# EAGLE design untitled (EAGLE 9.4.2)
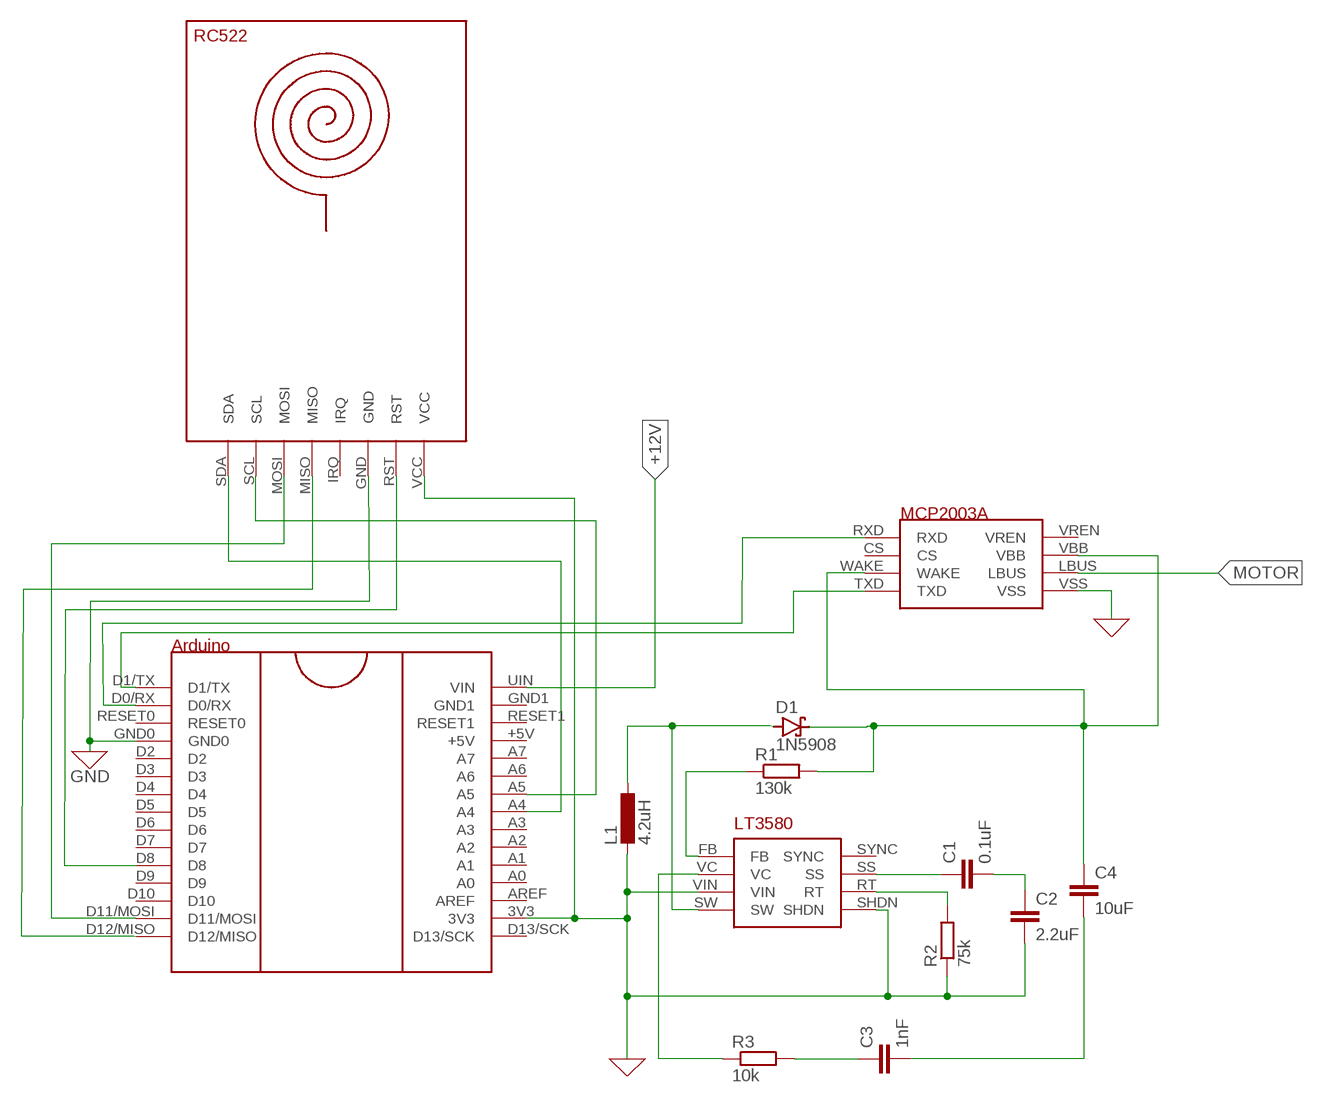
[diagram p0: schematic, sheet 1]

## Parts
C1  0.1uF  C-EU075-032X103  [C075-032X103]
C2  2.2uF  C-EU075-032X103  [C075-032X103]
C3  1nF  C-EU075-032X103  [C075-032X103]
C4  10uF  C-EU075-032X103  [C075-032X103]
D1  1N5908  [C4111-15]
L1  4.2uH  L-EU0207/7  [0207/7]
R1  130k  R-EU_0207/7  [0207/7]
R2  75k  R-EU_0207/7  [0207/7]
R3  10k  R-EU_0207/7  [0207/7]
U$1  ARDUINO  [ARDUINO]
U$2  LIN  [LIN]
U$3  LT3580  [LT3580]
U$4  RC522  [RC522]

## Nets
0: C2.2 L1.2 R2.1 U$1.3V3 U$2.VSS U$3.SHDN U$3.VIN U$4.VCC ; supply symbol labelled GND
+12V: U$1.UIN(VIN)
GND: U$1.GND0 U$4.GND
MOTOR: U$2.LBUS
N$1: C3.1 R3.2
N$2: C1.1 U$3.SS
N$3: C1.2 C2.1
N$4: U$1.A4 U$4.SDA
N$5: R2.2 U$3.RT
N$7: D1.A L1.1 U$3.SW
N$8: C4.1 D1.C R1.2 U$2.VBB U$2.WAKE
N$9: R1.1 U$3.FB
N$10: R3.1 U$3.VC
N$11: C3.2 C4.2
N$15: U$1.A5 U$4.SCL
N$16: U$1.D11/MOSI U$4.MOSI
N$17: U$1.D12/MISO U$4.MISO
N$19: U$1.D8 U$4.RST
N$20: U$1.D0/RX U$2.RXD
N$21: U$1.D1/TX U$2.TXD
Unconnected: U$1.+5V U$1.A0 U$1.A1 U$1.A2 U$1.A3 U$1.A6 U$1.A7 U$1.AREF U$1.D2 U$1.D3 U$1.D4 U$1.D5 U$1.D6 U$1.D7 U$1.D9 U$1.D10 U$1.D13/SCK U$1.GND1 U$1.RESET0 U$1.RESET1 U$2.CS U$2.VREN U$3.SYNC U$4.IRQ

## Library data of the parts
C1-C4 = rcl:C-EU: CAPACITOR, European symbol; SPICEPREFIX: C
D1 = diode:1N5908: DIODE schottky
L1 = rcl:L-EU: INDUCTOR, European symbol; SPICEPREFIX: L
R1-R3 = rcl:R-EU_: RESISTOR, European symbol; SPICEPREFIX: R
U$1 = Diplomarbeit:ARDUINO
U$2 = Diplomarbeit:LIN
U$3 = Diplomarbeit:LT3580
U$4 = Diplomarbeit:RC522

## Board
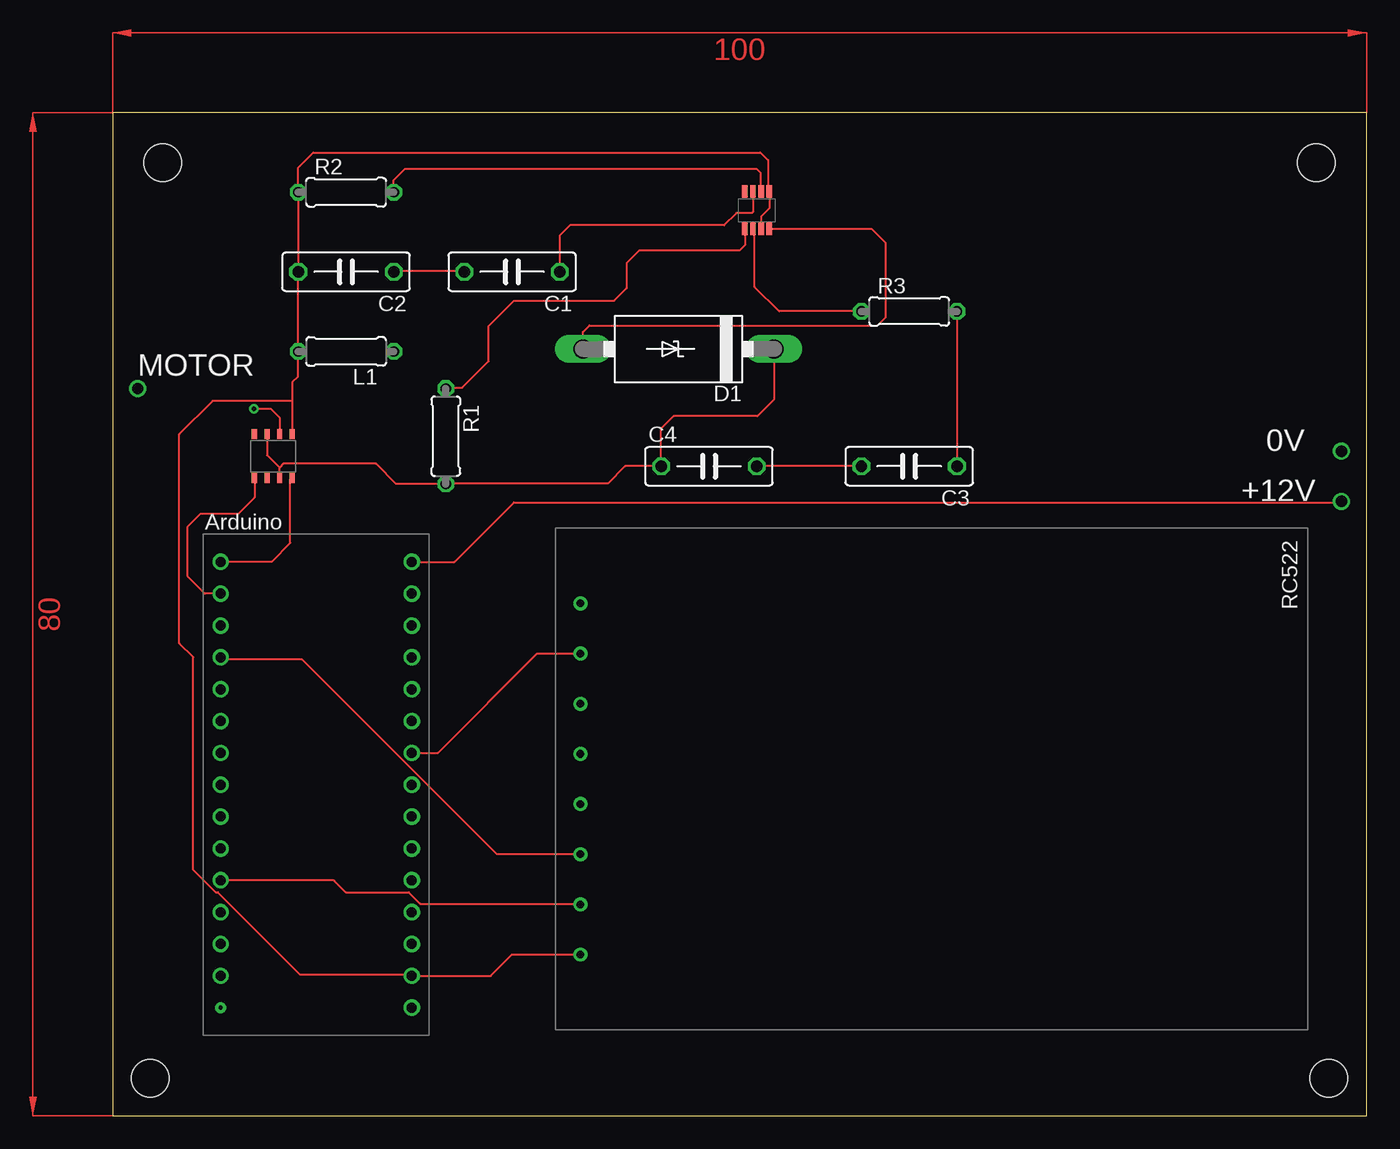
[diagram p1: board, top side]
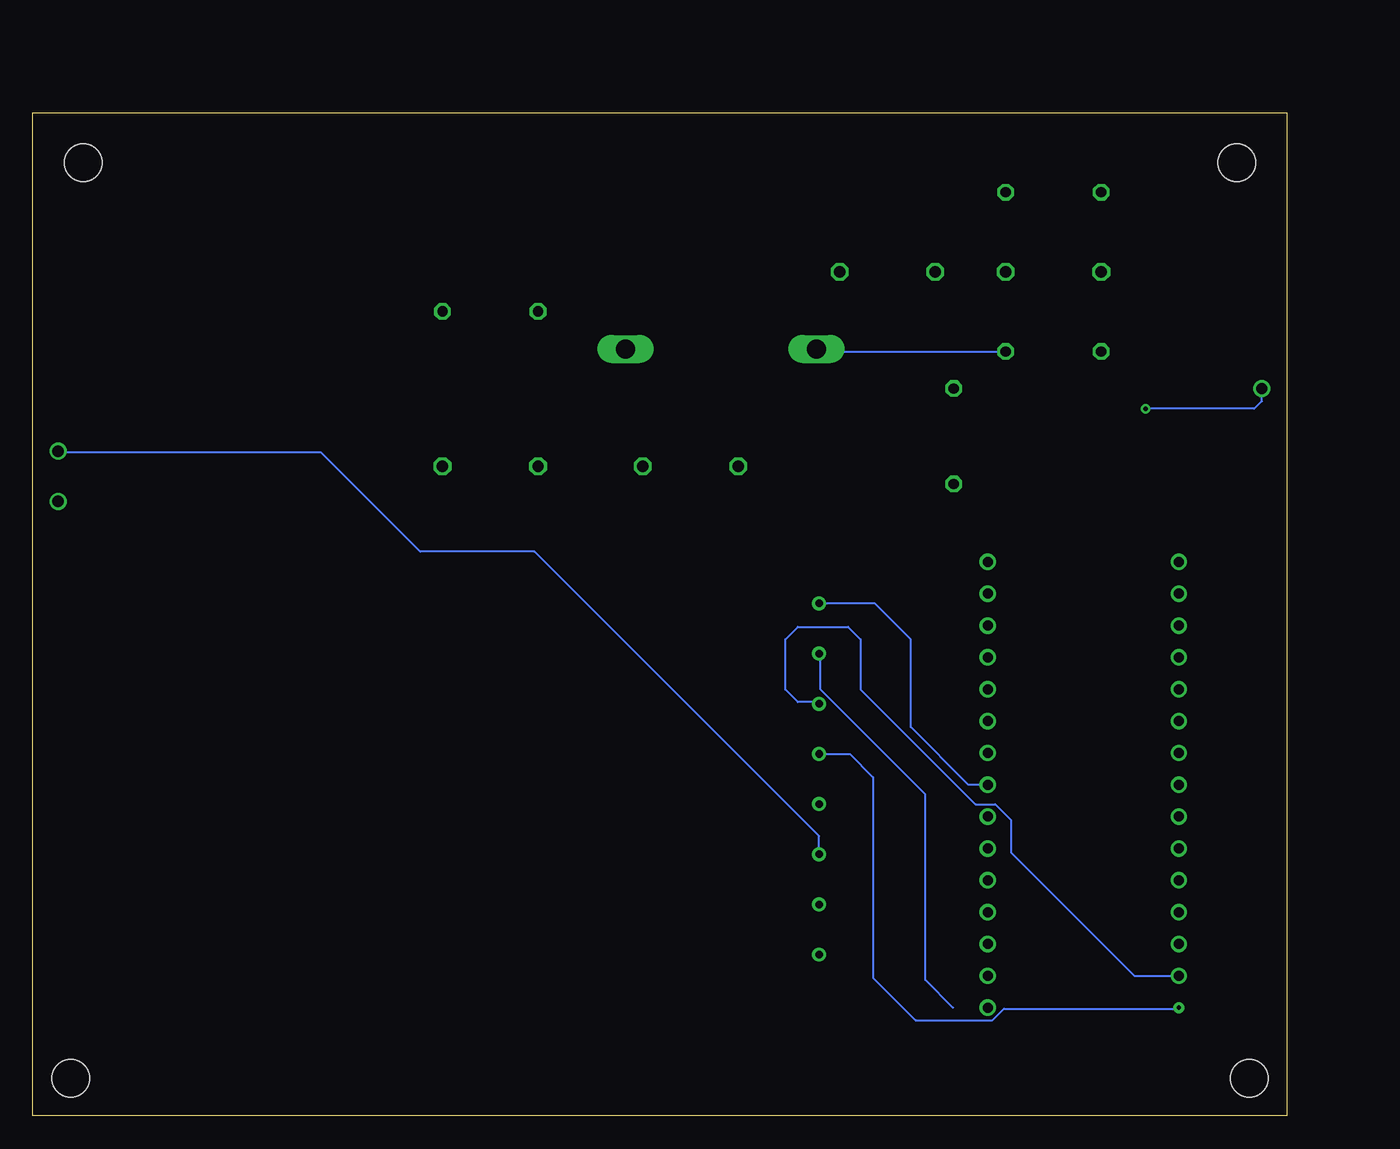
[diagram p2: board, bottom side, seen from below]

Size 100 x 80 mm. Coordinates in mm from the lower left corner, seen from the top.
Outline: 0,0 100,0 100,80 0,80 0,0
Copper layers (1*16): Top 0.035mm / dielectric 1.5mm / Bottom 0.035mm
Design rules "default": minimum track width 6mil, minimum drill 0.35mm, track to track 6mil, track to pad 6mil, pad to pad 6mil, via to via 6mil, smd to smd 6mil, copper to edge 40mil, drill to drill 6mil, minimum pad ring 10mil, minimum via ring 8mil, stop-mask expansion 4mil, vias tented up to drill 0mil, thermal gap 10mil
Holes 3 mm at 96,76 4,76 3,3 97,3

### Footprints (pad centres in the part's own frame; a part is rotated, then mirrored left to right if it is on the bottom)
C075-032X103 = drill 0.914 octagon: 1 -3.81,0; 2 3.81,0
C4111-15 = drill 1.499 long: A 7.62,0; C -7.62,0
0207/7 = drill 0.813 octagon: 1 -3.81,0; 2 3.81,0
ARDUINO = drill 0.8: 3V3 7.62,-15.24; +5V 7.62,10.16; A0 7.62,-10.16; A1 7.62,-7.62; A2 7.62,-5.08; A3 7.62,-2.54; A4 7.62,0; A5 7.62,2.54; A6 7.62,5.08; A7 7.62,7.62; AREF 7.62,-12.7; D0/RX -7.62,15.24; D1/TX -7.62,17.78; D2 -7.62,7.62; D3 -7.62,5.08; D4 -7.62,2.54; D5 -7.62,0; D6 -7.62,-2.54; D7 -7.62,-5.08; D8 -7.62,-7.62; D9 -7.62,-10.16; D10 -7.62,-12.7; D11/MOSI -7.62,-15.24; D13/SCK 7.62,-17.78; GND0 -7.62,10.16; GND1 7.62,15.24; RESET0 -7.62,12.7; RESET1 7.62,12.7; UIN 7.62,17.78 | drill 0.35: D12/MISO -7.62,-17.78
LIN = smd 0.406 x 0.813: CS -0.5,-1.75; LBUS 0.5,1.75; RXD -1.5,-1.75; TXD 1.5,-1.75; VBB -0.5,1.75; VREN -1.5,1.75; VSS 1.5,1.75; WAKE 0.5,-1.75
LT3580 = smd 0.42 x 1: FB -0.95,-1.5; RT 0.35,1.5; SHDN 1,1.5; SS -0.3,1.5; SW 1,-1.5; SYNC -0.95,1.5; VC -0.3,-1.5; VIN 0.35,-1.5
RC522 = drill 0.6: GND 6,-28; IRQ 2,-28; MISO -2,-28; MOSI -6,-28; RST 10,-28; SCL -10,-28; SDA -14,-28; VCC 14,-28

### Placement (x,y rotation side)
C1  31.86,67.31 180 top
C2  18.62,67.31 180 top
C3  63.53,51.8 180 top
C4  47.56,51.8 0 top
D1  45.13,61.15 180 top
L1  18.62,60.96 180 top
R1  26.57,54.2 270 top
R2  18.62,73.66 0 top
R3  63.53,64.15 0 top
U$1  16.24,26.4 0 top
U$2  12.81,52.61 0 top
U$3  51.37,72.23 0 top
U$4  65.31,26.86 270 top

### Tracks (layer width: path | path; a pad name or v marks a point on that pad's centre or on a via)
0
  Top 0.152: 51.82,70.87 U$3.VIN 51.72,71.72 52.37,72.37 U$3.SHDN | 52.27,73.61 U$3.SHDN | U$3.SHDN 52.27,73.76 52.27,76.22 51.66,76.83 16,76.83 14.81,75.64 R2.1 14.78,73.61 14.78,67.36 C2.2 14.78,67.21 14.78,60.96 | 14.33,57.02 14.33,58.5 14.78,58.96 14.78,60.96 | 14.33,57.02 14.33,54.41 U$2.VSS | 14.33,57.02 7.97,57.02 5.32,54.36 5.32,37.69 6.41,36.59 | 14.78,60.96 L1.2 | 6.44,36.56 6.41,36.59 | U$4.VCC 31.86,12.86 30.16,11.16 U$1.3V3 23.77,11.28 14.94,11.28 8.38,17.83 8.23,17.83 6.4,19.66 6.4,36.58 6.41,36.59
+12V  (via drill 0.9)
  Top 0.152: v98,49 97.99,48.92 32,48.92 27.26,44.18 U$1.UIN
GND  (via drill 0.9)
  Top 0.152: U$4.GND 37.19,20.88 30.63,20.88 15.09,36.42 8.69,36.42 8.69,36.49 U$1.GND0
  Bottom 0.152: v98,53 97.99,52.88 77,52.88 69.12,45 60,45 37.31,22.31 U$4.GND 37.34,20.88
MOTOR  (via drill 0.35, 0.9)
  Top 0.152: 13.26,54.41 U$2.LBUS 13.31,55.69 12.61,56.39 v11.28,56.39
  Bottom 0.152: v11.28,56.39 2.61,56.39 2,57 v2,58
N$1
  Top 0.152: R3.2 67.36,64.01 67.36,51.82 C3.1
N$2
  Top 0.152: 51.05,73.3 51.05,73.61 U$3.SS 51.07,72.07 51,72 49.75,72 48.77,71.02 36.47,71.02 35.67,70.22 C1.1
N$3
  Top 0.152: C2.1 22.55,67.36 28.04,67.36 C1.2
N$4
  Bottom 0.152: U$4.SDA 37.19,40.84 32.84,40.84 30,38 30,31 25.4,26.4 U$1.A4
N$5
  Top 0.152: R2.2 22.43,74.64 23.32,75.52 51.36,75.52 51.66,75.22 51.66,73.76 U$3.RT
N$7
  Top 0.152: U$3.SW 52.43,70.71 60.56,70.71 61.66,69.62 61.66,63.7 60.98,63.02 38.02,63.02 37.51,62.51 D1.A
  Bottom 0.152: L1.1 37.34,60.96 37.49,61.11 D1.A
N$8
  Top 0.152: 12.34,54.25 U$2.VBB 12.31,52.69 13.31,51.69 | 13.26,50.9 U$2.WAKE | 13.41,50.9 U$2.WAKE | 26.52,50.44 R1.2 | D1.C 52.75,57.13 51.42,55.8 44.75,55.8 43.75,54.8 C4.1 40.88,51.8 39.52,50.44 26.67,50.44 R1.2 | U$2.WAKE 13.31,51.69 | R1.2 22.61,50.39 21,52 13.62,52 13.31,51.69
N$9
  Top 0.152: 50.29,70.71 U$3.FB 50.42,69.42 50,69 42,69 41,68 41,66 40,65 32,65 30,63 30,60.17 27.89,58.06 26.67,58.06 R1.1
N$10
  Top 0.152: U$3.VC 51.21,70.71 51.21,66.1 53.15,64.16 59.59,64.16 R3.1
N$11
  Top 0.152: C4.2 51.51,51.82 59.59,51.82 C3.2
N$15
  Top 0.152: 23.93,28.96 U$1.A5 25.94,28.94 33.86,36.86 U$4.SCL
  Bottom 0.152: U$4.SCL 37.19,36.73 37.19,33.98 28.84,25.64 28.84,10.84 26.62,8.62
N$16
  Bottom 0.152: 37.34,32.92 U$4.MOSI 37.45,33 39,33 40,34 40,38 39,39 35,39 34,38 34,34 24.84,24.84 23.25,24.84 22,23.59 22,21 12.16,11.16 U$1.D11/MOSI
N$17
  Bottom 0.152: U$1.D12/MISO 8.69,8.53 22.55,8.53 23.47,7.62 29.62,7.62 33,11 33,27 34.86,28.86 U$4.MISO
N$19
  Top 0.152: U$4.RST 37.19,16.92 24.54,16.92 23.62,17.83 18.6,17.83 17.69,18.75 17.62,18.78 U$1.D8
N$20
  Top 0.152: U$1.D0/RX 7.36,41.64 6,43 6,47 7,48 10,48 11.31,49.31 U$2.RXD
N$21
  Top 0.152: U$2.TXD 14.17,50.75 14.17,45.68 12.67,44.18 U$1.D1/TX
(copper drawn outside any net)
  shapes: Top area x2

### Text on the board
tNames: MOTOR | 0V | +12V